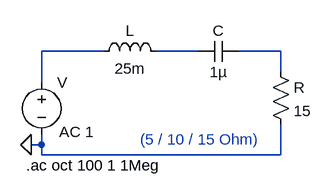
[diagram p0: schematic 3-3.asc]
3-3.asc, the LTspice schematic file:
Version 4.1
SHEET 1 880 680
WIRE 160 32 64 32
WIRE 304 32 240 32
WIRE 432 32 368 32
WIRE 432 64 432 32
WIRE 64 80 64 32
WIRE 64 176 64 160
WIRE 64 176 48 176
WIRE 64 192 64 176
WIRE 432 192 432 144
WIRE 432 192 64 192
FLAG 48 176 0
SYMBOL voltage 64 64 R0
WINDOW 123 27 92 Left 2
WINDOW 39 0 0 Left 0
SYMATTR InstName V
SYMATTR Value ""
SYMATTR Value2 AC 1
SYMBOL ind 144 48 R270
WINDOW 0 32 56 VTop 2
WINDOW 3 5 56 VBottom 2
SYMATTR InstName L
SYMATTR Value 25m
SYMATTR SpiceLine Rser=1m
SYMBOL cap 368 16 R90
WINDOW 0 0 32 VBottom 2
WINDOW 3 32 32 VTop 2
SYMATTR InstName C
SYMATTR Value 1µ
SYMBOL res 416 48 R0
SYMATTR InstName R
SYMATTR Value 15
TEXT 216 168 Left 2 ;(5 / 10 / 15 Ohm)
TEXT 40 208 Left 2 !.ac oct 100 1 1Meg

The netlist it stands for:
* 3-3.asc
V N001 0 AC 1
L N001 N002 25m Rser=1m
C N003 N002 1µ
R N003 0 15
* (5 / 10 / 15 Ohm)
.ac oct 100 1 1Meg
.backanno
.end